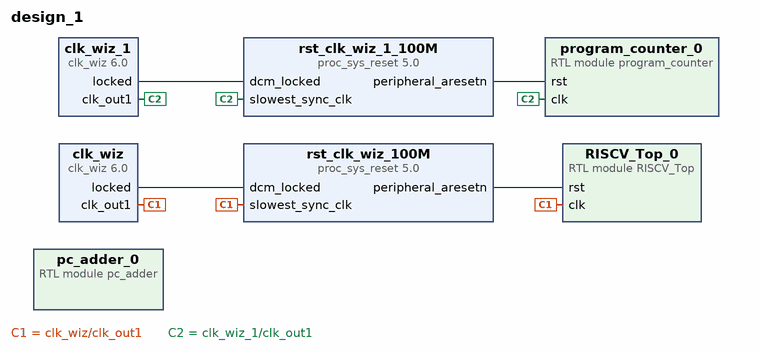
[diagram p0: block diagram of the top level]
# Vivado block design design_1, xc7z010iclg225-1L, Vivado 2018.2
create_bd_design design_1

create_bd_cell -type module -reference RISCV_Top RISCV_Top_0
create_bd_cell -type module -reference program_counter program_counter_0
create_bd_cell -type module -reference pc_adder pc_adder_0
create_bd_cell -type ip -vlnv xilinx.com:ip:clk_wiz:6.0 clk_wiz
create_bd_cell -type ip -vlnv xilinx.com:ip:proc_sys_reset:5.0 rst_clk_wiz_100M
create_bd_cell -type ip -vlnv xilinx.com:ip:clk_wiz:6.0 clk_wiz_1
create_bd_cell -type ip -vlnv xilinx.com:ip:proc_sys_reset:5.0 rst_clk_wiz_1_100M

# ---- connections ----

connect_bd_net [get_bd_pins clk_wiz/clk_out1] [get_bd_pins RISCV_Top_0/clk] [get_bd_pins rst_clk_wiz_100M/slowest_sync_clk]
connect_bd_net [get_bd_pins clk_wiz/locked] [get_bd_pins rst_clk_wiz_100M/dcm_locked]
connect_bd_net [get_bd_pins rst_clk_wiz_100M/peripheral_aresetn] [get_bd_pins RISCV_Top_0/rst]
connect_bd_net [get_bd_pins clk_wiz_1/clk_out1] [get_bd_pins program_counter_0/clk] [get_bd_pins rst_clk_wiz_1_100M/slowest_sync_clk]
connect_bd_net [get_bd_pins clk_wiz_1/locked] [get_bd_pins rst_clk_wiz_1_100M/dcm_locked]
connect_bd_net [get_bd_pins rst_clk_wiz_1_100M/peripheral_aresetn] [get_bd_pins program_counter_0/rst]

validate_bd_design
save_bd_design
